# EAGLE board 001000-004 (EAGLE 9.4.0)
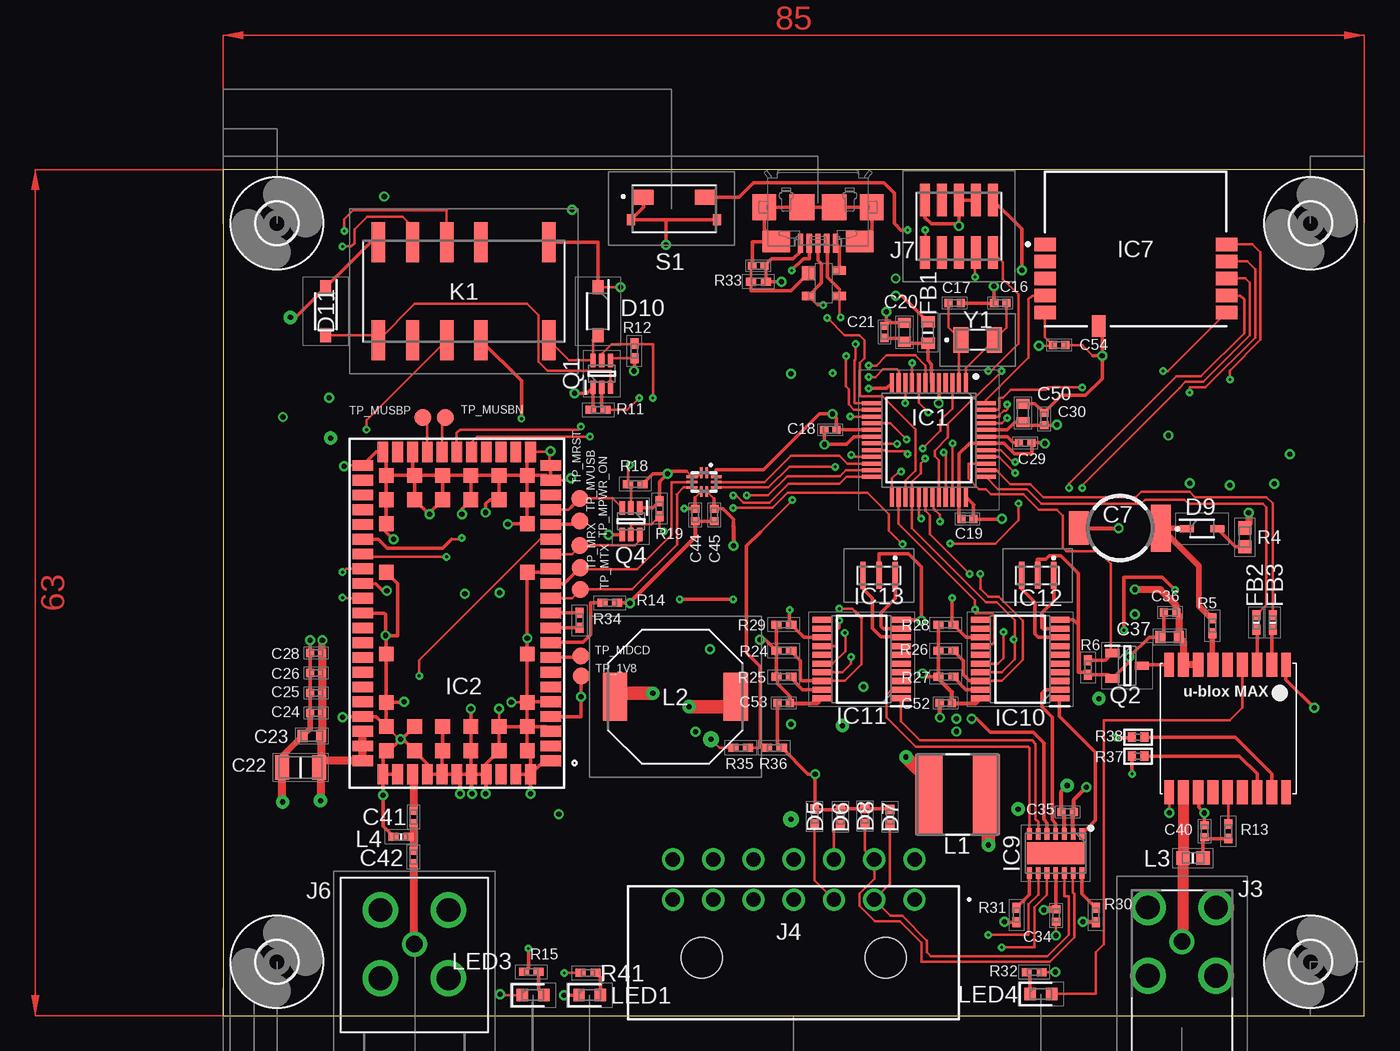
[diagram p6: board, top side]
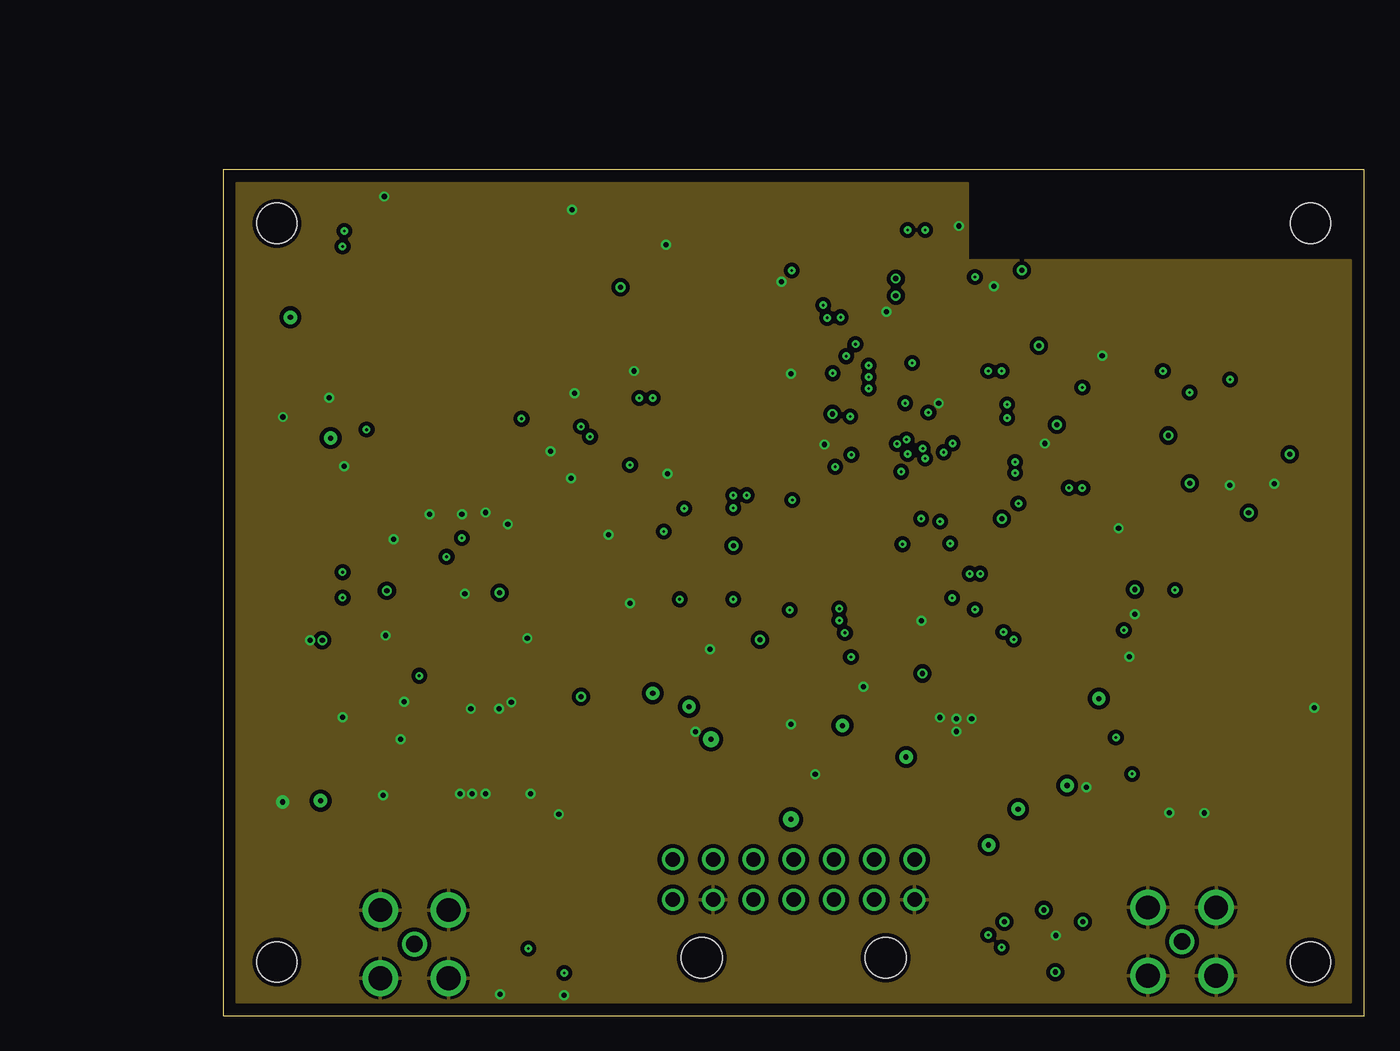
[diagram p7: board, inner layer Route2]
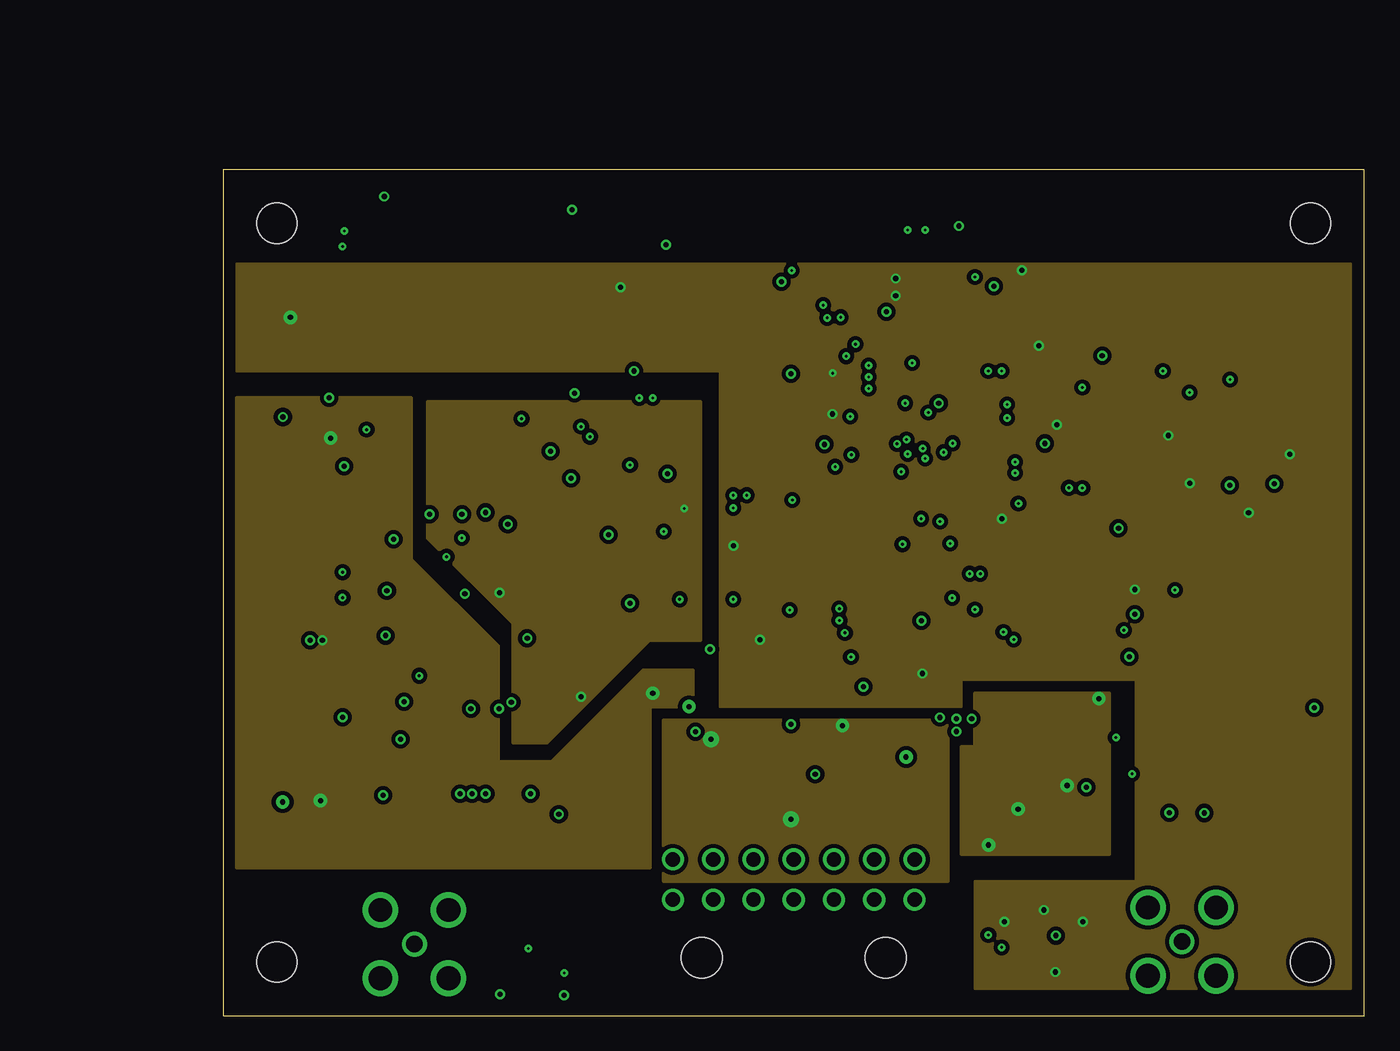
[diagram p8: board, inner layer Route15]
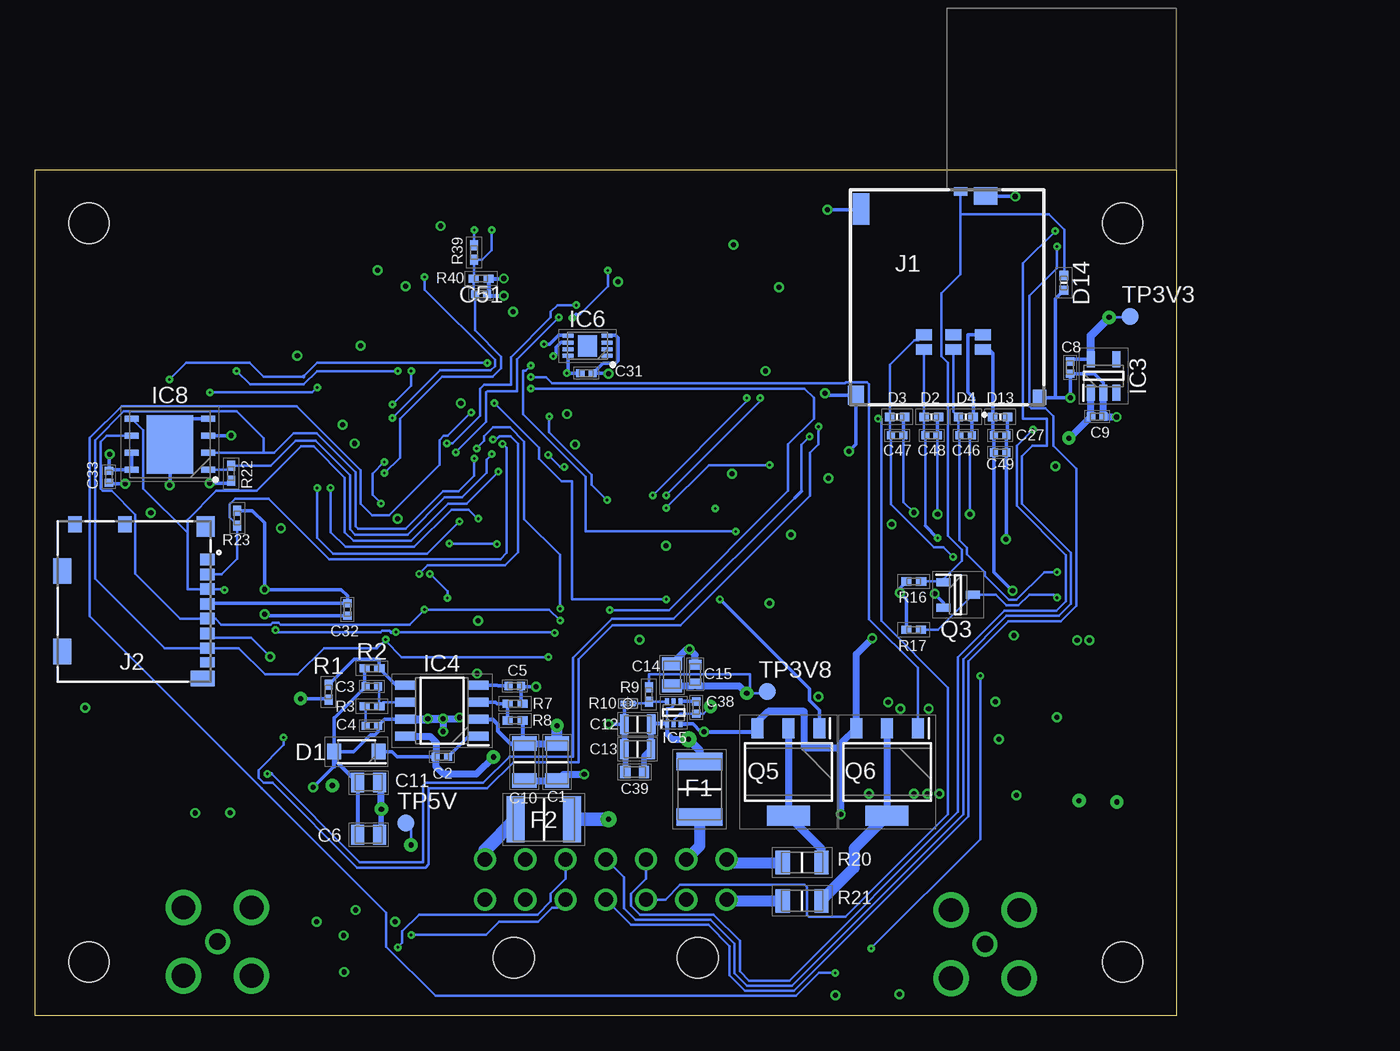
[diagram p9: board, bottom side, seen from below]

Size 85 x 63 mm. Coordinates in mm from the lower left corner, seen from the top.
Outline: 0,0 85,0 85,63 0,63 0,0
Copper layers (1*2*15*16): Top 0.048259375mm / dielectric 0.10921875mm / Route2 0.03048125mm / dielectric 47mil / Route15 0.03048125mm / dielectric 0.10921875mm / Bottom 0.048259375mm
Design rules "SparkFun-4-layer-TIGHT *": minimum track width 8mil, minimum drill 8mil, track to track 7mil, track to pad 7mil, pad to pad 7mil, via to via 7mil, smd to smd 7mil, copper to edge 7mil, drill to drill 7mil, minimum pad ring 7mil, minimum via ring 7mil, stop-mask expansion 4mil, vias tented up to drill 25mil, thermal gap 10mil
Net classes: 1 ant_wide: width 0.8 mm; 2 signal: width 0.203 mm, drill 0.203 mm, clearance 0.152 mm

## Footprints (pad centres in the part's own frame; a part is rotated, then mirrored left to right if it is on the bottom)
CAPC3216X180N = smd 1.07 x 1.82: 1 -1.38,0; 2 1.38,0
CAPC1005X55N = smd 0.6 x 0.62: 1 -0.46,0; 2 0.46,0
CAPC2012X145N = smd 0.97 x 1.47: 1 -0.83,0; 2 0.83,0
DSK-414_HL = smd 3.5 x 1.5: 1 0,3.05 | smd 2.5 x 1.5: 2 0,-3.05
CAPC2012X100N = smd 0.62 x 1.47: 1 -1,0; 2 1,0
CAPC1608X90N = smd 0.75 x 0.94: 1 -0.7,0; 2 0.7,0
SODFL3617X108N = smd 1.03 x 1.17: 1 -1.65,0; 2 1.65,0
DIONC1005X43N = smd 0.7 x 0.65: 1 -0.55,0; 2 0.55,0
SOD2513X110N = smd 1.05 x 0.5: 1 -1.138,0; 2 1.138,0
SOD3716X135N = smd 1.05 x 0.85: 1 -1.8,0; 2 1.8,0
SOT190P230X110-4N = smd 1 x 1: 1 -1.15,0.75 | smd 1 x 0.6: 2 -1.15,-0.95; 3 1.15,-0.95; 4 1.15,0.95
FUSC4632X62N = smd 1.31 x 3.43: 1 -2.065,0; 2 2.065,0
FUSC4632X194N = smd 1.35 x 3.43: 1 -2.1,0; 2 2.1,0
BEADC1608X95N = smd 0.85 x 1: 1 -0.8,0; 2 0.8,0
BEADC1005X55N = smd 0.75 x 0.6: 1 -0.55,0; 2 0.55,0
3,0 = hole 3: 0,0
QFP50P900X900X120-48N = smd 1.475 x 0.3: 1 -4.238,2.75; 2 -4.238,2.25; 3 -4.238,1.75; 4 -4.238,1.25; 5 -4.238,0.75; 6 -4.238,0.25; 7 -4.238,-0.25; 8 -4.238,-0.75; 9 -4.238,-1.25; 10 -4.238,-1.75; 11 -4.238,-2.25; 12 -4.238,-2.75; 25 4.238,-2.75; 26 4.238,-2.25; 27 4.238,-1.75; 28 4.238,-1.25; 29 4.238,-0.75; 30 4.238,-0.25; 31 4.238,0.25; 32 4.238,0.75; 33 4.238,1.25; 34 4.238,1.75; 35 4.238,2.25; 36 4.238,2.75 | smd 0.3 x 1.475: 13 -2.75,-4.238; 14 -2.25,-4.238; 15 -1.75,-4.238; 16 -1.25,-4.238; 17 -0.75,-4.238; 18 -0.25,-4.238; 19 0.25,-4.238; 20 0.75,-4.238; 21 1.25,-4.238; 22 1.75,-4.238; 23 2.25,-4.238; 24 2.75,-4.238; 37 2.75,4.238; 38 2.25,4.238; 39 1.75,4.238; 40 1.25,4.238; 41 0.75,4.238; 42 0.25,4.238; 43 -0.25,4.238; 44 -0.75,4.238; 45 -1.25,4.238; 46 -1.75,4.238; 47 -2.25,4.238; 48 -2.75,4.238
SARA-U201-03B = smd 1.5 x 0.8: 1 1,11; 2 1,9.9; 3 1,8.8; 4 1,7.7; 5 1,6.6; 6 1,5.5; 7 1,4.4; 8 1,3.3; 9 1,2.2; 10 1,1.1; 11 1,0; 12 1,-1.1; 13 1,-2.2; 14 1,-3.3; 15 1,-4.4; 16 1,-5.5; 17 1,-6.6; 18 1,-7.7; 19 1,-8.8; 20 1,-9.9; 21 1,-11; 33 15,-11; 34 15,-9.9; 35 15,-8.8; 36 15,-7.7; 37 15,-6.6; 38 15,-5.5; 39 15,-4.4; 40 15,-3.3; 41 15,-2.2; 42 15,-1.1; 43 15,0; 44 15,1.1; 45 15,2.2; 46 15,3.3; 47 15,4.4; 48 15,5.5; 49 15,6.6; 50 15,7.7; 51 15,8.8; 52 15,9.9; 53 15,11 | smd 0.8 x 1.5: 22 2.5,-12; 23 3.6,-12; 24 4.7,-12; 25 5.8,-12; 26 6.9,-12; 27 8,-12; 28 9.1,-12; 29 10.2,-12; 30 11.3,-12; 31 12.4,-12; 32 13.5,-12; 54 13.5,12; 55 12.4,12; 56 11.3,12; 57 10.2,12; 58 9.1,12; 59 8,12; 60 6.9,12; 61 5.8,12; 62 4.7,12; 63 3.6,12; 64 2.5,12 | smd 1.1 x 1.1: 65 2.75,10.25; 66 4.85,10.25; 67 6.95,10.25; 68 9.05,10.25; 69 11.15,10.25; 70 13.25,10.25; 71 2.75,8.45; 72 4.85,8.45; 73 6.95,8.45; 74 9.05,8.45; 75 11.15,8.45; 76 13.25,8.45; 77 2.75,6.65; 78 13.25,6.65; 79 2.75,3.05; 80 13.25,3.05; 81 2.75,-3.05; 82 13.25,-3.05; 83 2.75,-6.65; 84 13.25,-6.65; 85 2.75,-8.45; 86 4.85,-8.45; 87 6.95,-8.45; 88 9.05,-8.45; 89 11.15,-8.45; 90 13.25,-8.45; 91 2.75,-10.25; 92 4.85,-10.25; 93 6.95,-10.25; 94 9.05,-10.25; 95 11.15,-10.25; 96 13.25,-10.25
SOT95P282X130-5N = smd 1.2 x 0.6: 1 -1.25,0.95; 2 -1.25,0; 3 -1.25,-0.95; 4 1.25,-0.95; 5 1.25,0.95
SOIC127P600X175-8N = smd 1.525 x 0.65: 1 -2.712,1.905; 2 -2.712,0.635; 3 -2.712,-0.635; 4 -2.712,-1.905; 5 2.712,-1.905; 6 2.712,-0.635; 7 2.712,0.635; 8 2.712,1.905
SOTFL50P160X60-6N = smd 0.475 x 0.3: 1 -0.838,0.5; 2 -0.838,0; 3 -0.838,-0.5; 4 0.838,-0.5; 5 0.838,0; 6 0.838,0.5
SON50P300X200X60-9N = smd 0.85 x 0.3: 1 -1.45,0.75; 2 -1.45,0.25; 3 -1.45,-0.25; 4 -1.45,-0.75; 5 1.45,-0.75; 6 1.45,-0.25; 7 1.45,0.25; 8 1.45,0.75 | smd 1.4 x 1.6: 9 0,0
XCVR_SPBTLE-RF = smd 1.6 x 1: 1 -6.75,0.33; 2 -6.75,-0.94; 3 -6.75,-2.21; 4 -6.75,-3.48; 5 -6.75,-4.75; 7 6.75,-4.75; 8 6.75,-3.48; 9 6.75,-2.21; 10 6.75,-0.94; 11 6.75,0.33 | smd 1 x 1.6: 6 -2.75,-5.75
SON127P600X500X80-9N = smd 1.05 x 0.45: 1 -2.85,1.905; 2 -2.85,0.635; 3 -2.85,-0.635; 4 -2.85,-1.905; 5 2.85,-1.905; 6 2.85,-0.635; 7 2.85,0.635; 8 2.85,1.905 | smd 3.45 x 4.35: 9 0,0
SON65P300X450X100-15N = smd 0.85 x 0.35: 1 -1.45,1.95; 2 -1.45,1.3; 3 -1.45,0.65; 4 -1.45,0; 5 -1.45,-0.65; 6 -1.45,-1.3; 7 -1.45,-1.95; 8 1.45,-1.95; 9 1.45,-1.3; 10 1.45,-0.65; 11 1.45,0; 12 1.45,0.65; 13 1.45,1.3; 14 1.45,1.95 | smd 1.65 x 4.25: 15 0,0
SOP65P640X120-20N = smd 1.475 x 0.45: 1 -2.938,2.925; 2 -2.938,2.275; 3 -2.938,1.625; 4 -2.938,0.975; 5 -2.938,0.325; 6 -2.938,-0.325; 7 -2.938,-0.975; 8 -2.938,-1.625; 9 -2.938,-2.275; 10 -2.938,-2.925; 11 2.938,-2.925; 12 2.938,-2.275; 13 2.938,-1.625; 14 2.938,-0.975; 15 2.938,-0.325; 16 2.938,0.325; 17 2.938,0.975; 18 2.938,1.625; 19 2.938,2.275; 20 2.938,2.925
CSTCE16M0V53CR0 = smd 0.4 x 2: 1 1.2,0; 2 0,0; 3 -1.2,0
SF56S006V4BR2000 = smd 1.2 x 0.8: 1 2.66,-12.09; 2 0.47,-12.09; 3 -1.72,-12.09; 4 2.66,-10.99; 5 0.47,-10.99; 6 -1.72,-10.99 | smd 1.75 x 1.3: 7 2.87,-0.65 | smd 1 x 0.65: 8 1,-0.325 | smd 1.2 x 2.35: 9 -6.4,-1.625 | smd 1.2 x 1.4: 10 -6.8,-15.5 | smd 1 x 1.1: 11 6.9,-15.65
1040310811 = smd 0.85 x 1.1: 1 3.105,0.25; 2 2.005,0.25; 3 0.905,0.25; 4 -0.195,0.25; 5 -1.295,0.25; 6 -2.395,0.25; 7 -3.495,0.25 | smd 0.75 x 1.1: 8 -4.545,0.25 | smd 1.17 x 1.8: 9 -5.755,0.6 | smd 1.9 x 1.35: 10 -3.73,11.075; 11 2.24,11.075 | smd 1.2 x 1: 12 5.74,10.1; 13 5.74,6.4 | smd 1.55 x 1.35: 14 5.565,0.375
FA1NCRPPCB8 = drill 1.77 pad 2.655: 1 3.85,-2.54; 2 8.93,-2.54; 3 8.93,2.54; 4 3.85,2.54 | drill 1.24 pad 1.86: 5 6.39,0
43045-1400 = drill 1.07 pad 1.65: 1 9,8.92; 2 6,8.92; 3 3,8.92; 4 0,8.92; 5 -3,8.92; 6 -6,8.92; 7 -9,8.92; 8 9,11.92; 9 6,11.92; 10 3,11.92; 11 0,11.92; 12 -3,11.92; 13 -6,11.92; 14 -9,11.92 | hole 3.05: -6.85,4.6; 6.85,4.6
ZX62-AB-5PA = smd 0.4 x 1.35: 1 -1.3,3.025; 2 -0.65,3.025; 3 0,3.025; 4 0.65,3.025; 5 1.3,3.025 | smd 2.1 x 1.6: 6 3.1,2.9; 11 -3.1,2.9 | smd 1.8 x 1.9: 7 4,0.35; 10 -4,0.35 | smd 1.9 x 1.9: 8 1.2,0.35; 9 -1.2,0.35
FA1NDRPPCB8 = drill 1.77 pad 2.655: 1 0,0; 2 5.08,0; 3 0,-5.08; 4 5.08,-5.08 | drill 1.24 pad 1.86: 5 2.54,-2.54
M503600542R = smd 0.74 x 2.4: 1 -2.54,-1.95; 2 -2.54,1.95; 3 -1.27,-1.95; 4 -1.27,1.95; 5 0,-1.95; 6 0,1.95; 7 1.27,-1.95; 8 1.27,1.95; 9 2.54,-1.95; 10 2.54,1.95
EE25TNU = smd 1 x 3: 1 -6.35,-3.645; 3 -1.27,-3.645; 4 1.27,-3.645; 5 3.81,-3.645; 6 6.35,-3.645; 7 6.35,3.645; 8 3.81,3.645; 9 1.27,3.645; 10 -1.27,3.645; 12 -6.35,3.645
SRN6045_1 = smd 2.01 x 6: 1 -2.15,0; 2 2.15,0
SRU10484R7Y = smd 1.8 x 3.6: 1 -4.5,0; 2 4.5,0
INDC1608X95N = smd 1 x 1: 1 -0.75,0; 2 0.75,0
INDC1005X55N = smd 0.75 x 0.6: 1 -0.55,0; 2 0.55,0
LEDC1608X90N = smd 0.85 x 0.95: 1 -0.8,0; 2 0.8,0
LEDC1608X80N = smd 0.85 x 0.95: 1 -0.8,0; 2 0.8,0
SOT65P210X100-6N = smd 1 x 0.4: 1 -1,0.65; 2 -1,0; 3 -1,-0.65; 4 1,-0.65; 5 1,0; 6 1,0.65
SOT95P230X110-3N = smd 1.05 x 0.6: 1 -1.1,0.95; 2 -1.1,-0.95; 3 1.1,0
SOT230P700X170-4N = smd 1.5 x 0.9: 1 -3.25,2.3; 2 -3.25,0; 3 -3.25,-2.3 | smd 1.5 x 3.2: 4 3.25,0
RESC1005X40N = smd 0.75 x 0.6: 1 -0.55,0; 2 0.55,0
RESC1508X50N = smd 1 x 0.95: 1 -0.7,0; 2 0.7,0
RESC0603X26N = smd 0.44 x 0.42: 1 -0.34,0; 2 0.34,0
RESC1005X35N = smd 0.7 x 0.6: 1 -0.55,0; 2 0.55,0
RESC3116X65N = smd 1.05 x 1.75: 1 -1.45,0; 2 1.45,0
R0402 = smd 0.6 x 0.7: 1 -0.476,0; 2 0.476,0
TL4100AF120QG = smd 1.45 x 1.1: 1 -2.075,0.837; 2 2.475,0.837 | smd 0.6 x 0.85: 3 -3,-0.838; 4 3.4,-0.838
B1,27 = smd 1.27 x 1.27: TP 0,0
RSW(RPUQFNN10) = smd 0.2 x 0.8: 1 -0.2,-0.7; 2 0.2,-0.7; 6 0.2,0.7; 7 -0.2,0.7 | smd 0.8 x 0.2: 3 0.9,-0.4; 4 0.9,0; 5 0.9,0.4; 8 -0.9,0.4; 9 -0.9,0; 10 -0.9,-0.4
MAX-M8 = smd 1.8 x 0.7: 1_GND 4.95,-4.4; 9_RESET_N 4.95,4.3; 10_GND -4.55,4.3; 18_SAFEBOOT_N -4.55,-4.4 | smd 1.8 x 0.8: 2_TXD 4.95,-3.35; 3_RXD 4.95,-2.25; 4_TIMEPULSE 4.95,-1.15; 5_EXTINT 4.95,-0.05; 6_V_BCKP 4.95,1.05; 7_VCC_IO 4.95,2.15; 8_VCC 4.95,3.25; 11_RF_IN -4.55,3.25; 12_GND -4.55,2.15; 13_LNA_EN -4.55,1.05; 14_VCC_RF -4.55,-0.05; 15_V_ANT/RESERVED -4.55,-1.15; 16_SDA -4.55,-2.25; 17_SCL -4.55,-3.35
ABS0716632768KHZT = smd 1.1 x 1.9: 1 -1.25,0; 2 1.25,0

## Placement (x,y rotation side)
C1  C3216X7R1V106K160AC  [CAPC3216X180N]  46.13,18.88 90 bottom
C2  100n  [CAPC1005X55N]  54.71,19.27 0 bottom
C3  10p  [CAPC1005X55N]  59.92,24.49 0 bottom
C4  2n2  [CAPC1005X55N]  59.92,21.58 180 bottom
C5  8n2  [CAPC1005X55N]  49.28,24.55 180 bottom
C6  10u  [CAPC2012X145N]  60.17,13.46 0 bottom
C7  DSK-3R3H224U-HL  [DSK-414_HL]  66.8,36.3 270 top
C8  1u  [CAPC1005X55N]  7.92,48.25 90 bottom
C9  1u  [CAPC1005X55N]  5.89,44.6 180 bottom
C10  C3216X7R1V106K160AC  [CAPC3216X180N]  48.58,18.88 90 bottom
C11  10u  [CAPC2012X145N]  60.17,17.35 0 bottom
C12  C2012X5R1V106K085AC  [CAPC2012X100N]  40.12,21.69 0 bottom
C13  C2012X5R1V106K085AC  [CAPC2012X100N]  40.13,19.83 0 bottom
C14  C2012X5R1A336M125AC  [CAPC2012X145N]  37.56,25.37 270 bottom
C15  GRM188R71H104KA93D  [CAPC1608X90N]  35.85,25.41 270 bottom
C16  20p  [CAPC1005X55N]  57.89,53.06 0 top
C17  20p  [CAPC1005X55N]  54.48,53.06 180 top
C18  100n  [CAPC1005X55N]  45.23,43.63 0 top
C19  100n  [CAPC1005X55N]  55.44,36.97 0 top
C20  10u  [CAPC1608X90N]  50.75,50.89 270 top
C21  100n  [CAPC1005X55N]  49.26,50.92 270 top
C22  100u  [CAPC3216X180N]  5.77,18.46 0 top
C23  10u  [CAPC1608X90N]  6.61,20.82 0 top
C24  100n  [CAPC1005X55N]  6.92,22.54 0 top
C25  10n  [CAPC1005X55N]  6.92,24.03 0 top
C26  68p  [CAPC1005X55N]  6.92,25.52 0 top
C27  100n  [CAPC1005X55N]  13.12,43.21 180 bottom
C28  15p  [CAPC1005X55N]  6.92,27 0 top
C29  1u  [CAPC1005X55N]  59.75,42.65 0 top
C30  100n  [CAPC1005X55N]  61.16,44.44 90 top
C31  100n  [CAPC1005X55N]  43.94,47.84 180 bottom
C32  10u  [CAPC1005X55N]  61.75,30.25 90 bottom
C33  100n  [CAPC1005X55N]  79.51,40.13 90 bottom
C34  100n  [CAPC1005X55N]  62.05,7.46 90 top
C35  100n  [CAPC1005X55N]  62.91,15.16 0 top
C36  47p  [CAPC1005X55N]  70.53,30.01 180 top
C37  1u  [CAPC1608X90N]  70.5,28.19 180 top
C38  100n  [CAPC1005X55N]  35.75,22.93 90 bottom
C39  GRM188R71H104KA93D  [CAPC1608X90N]  40.35,18.15 0 bottom
C40  10n  [CAPC1005X55N]  73.11,13.73 270 top
C41  GRM1555C1H150JA01J  [CAPC1005X55N]  14.18,14.79 270 top
C42  GRM1555C1H330JA01J  [CAPC1005X55N]  14.18,11.82 270 top
C43  4n7  [CAPC1005X55N]  39.87,55.84 0 top
C44  100n  [CAPC1005X55N]  35.16,37.28 270 top
C45  100n  [CAPC1005X55N]  36.58,37.28 90 top
C46  GRM1555C1H470JA01D  [CAPC1005X55N]  15.68,43.21 180 bottom
C47  GRM1555C1H470JA01D  [CAPC1005X55N]  20.79,43.21 180 bottom
C48  GRM1555C1H470JA01D  [CAPC1005X55N]  18.24,43.21 180 bottom
C49  GRM1555C1H470JA01D  [CAPC1005X55N]  13.12,41.93 180 bottom
C50  10u  [CAPC1608X90N]  59.57,44.88 90 top
C51  GCM1555C1H101JA16D  [CAPC1005X55N]  51.79,53.72 0 bottom
C52  100n  [CAPC1005X55N]  53.83,23.27 180 top
C53  100n  [CAPC1005X55N]  41.77,23.27 180 top
C54  100n  [CAPC1005X55N]  62.28,49.93 180 top
D1  SS13FL  [SODFL3617X108N]  61.08,19.65 180 bottom
D2  PESD0402-140  [DIONC1005X43N]  18.24,44.58 180 bottom
D3  PESD0402-140  [DIONC1005X43N]  20.79,44.58 180 bottom
D4  PESD0402-140  [DIONC1005X43N]  15.68,44.58 180 bottom
D5  PESD0402-140  [DIONC1005X43N]  44.06,14.82 270 top
D6  PESD0402-140  [DIONC1005X43N]  45.98,14.79 270 top
D7  PESD0402-140  [DIONC1005X43N]  49.67,14.79 270 top
D8  PESD0402-140  [DIONC1005X43N]  47.81,14.86 270 top
D9  BAT60AE6327HTSA1  [SOD2513X110N]  72.93,36.26 0 top
D10  MBR0560-TP  [SOD3716X135N]  27.92,52.45 270 top
D11  MBR0560-TP  [SOD3716X135N]  7.63,52.45 270 top
D12  PRTR5V  [SOT190P230X110-4N]  44.74,54.53 0 top
D13  PESD0402-140  [DIONC1005X43N]  13.12,44.58 180 bottom
D14  PESD0402-140  [DIONC1005X43N]  8.38,54.56 90 bottom
F1  MINISMDC050F-2  [FUSC4632X62N]  35.51,16.86 270 bottom
F2  MINISMDC150F_24-2  [FUSC4632X194N]  47.12,14.61 180 bottom
FB1  BLM18PG471SZ1D  [BEADC1608X95N]  52.5,50.87 270 top
FB2  BLM15HD102SN1D  [BEADC1005X55N]  76.95,29.27 90 top
FB3  BLM15HD102SN1D  [BEADC1005X55N]  78.19,29.27 90 top
H1  MOUNT-HOLE3.0  [3,0]  81,59 0 top
H4  MOUNT-HOLE3.0  [3,0]  81,4 0 top
H5  MOUNT-HOLE3.0  [3,0]  4,4 0 top
H6  MOUNT-HOLE3.0  [3,0]  4,59 0 top
IC1  ATSAMD21G18A-AU  [QFP50P900X900X120-48N]  52.57,42.86 270 top
IC2  SARA-R410M-02B  [SARA-U201-03B]  25.4,29.97 180 top
IC3  AP2112K-3.3TRG1  [SOT95P282X130-5N]  5.42,47.63 90 bottom
IC4  TPS54232D  [SOIC127P600X175-8N]  54.71,22.7 180 bottom
IC5  TPS563231DRLR  [SOTFL50P160X60-6N]  37.44,22.56 90 bottom
IC6  ATECC508A-MAHDA-T  [SON50P300X200X60-9N]  43.86,49.87 180 bottom
IC7  SPBTLE-RF  [XCVR_SPBTLE-RF]  67.98,57.1 0 top
IC8  W25Q16JVZPIQ  [SON127P600X500X80-9N]  74.96,42.54 180 bottom
IC9  TJA1048TK,118  [SON65P300X450X100-15N]  62.01,12.08 270 top
IC10  MCP2515T-I_ST  [SOP65P640X120-20N]  59.37,26.54 180 top
IC11  MCP2515T-I_ST  [SOP65P640X120-20N]  47.56,26.54 180 top
IC12  CSTCE16M0V53C-R0  [CSTCE16M0V53CR0]  60.67,32.78 0 top
IC13  CSTCE16M0V53C-R0  [CSTCE16M0V53CR0]  48.86,32.78 0 top
J1  SF56S006V4BR2000  [SF56S006V4BR2000]  17.08,61.7 0 bottom
J2  1040310811  [1040310811]  71.93,30.85 90 bottom
J3  FA1-NCRP-PCB-8  [FA1NCRPPCB8]  71.43,-0.88 90 top
J4  43045-1400  [43045-1400]  42.5,-0.29 0 top
J5  -  [ZX62-AB-5PA]  44.31,60.54 180 top
J6  FA1-NDRP-PCB-8  [FA1NDRPPCB8]  11.7,7.86 0 top
J7  M50-3600542R  [M503600542R]  54.81,58.78 180 top
K1  EE2-3TNU-L  [EE25TNU]  17.92,53.94 180 top
L1  SRN6045-150M  [SRN6045_1]  54.72,16.46 0 top
L2  SRU1048-4R7Y  [SRU10484R7Y]  33.68,23.74 180 top
L3  27nH  [INDC1608X95N]  72.24,11.72 180 top
L4  LQG15HN39NJ02D  [INDC1005X55N]  13.25,13.31 0 top
LED1  HSMG-C190  [LEDC1608X90N]  27.3,1.52 0 top
LED3  HSMS-C190  [LEDC1608X90N]  23.08,1.52 0 top
LED4  HSMR-C190  [LEDC1608X80N]  60.91,1.61 0 top
Q1  2N7002DW-7-F  [SOT65P210X100-6N]  28.2,47.79 90 top
Q2  2N7002,215  [SOT95P230X110-3N]  67.34,26.05 0 top
Q3  2N7002,215  [SOT95P230X110-3N]  16.26,31.33 0 bottom
Q4  2N7002DW-7-F  [SOT65P210X100-6N]  30.37,36.81 270 top
Q5  BSP76E6433HUMA1  [SOT230P700X170-4N]  28.89,18.14 270 bottom
Q6  BSP76E6433HUMA1  [SOT230P700X170-4N]  21.54,18.14 270 bottom
R1  10k2  [RESC1005X40N]  63.16,24.08 270 bottom
R2  1k96  [RESC1005X40N]  59.92,25.87 0 bottom
R3  28k  [RESC1005X40N]  59.92,23.04 0 bottom
R4  10k  [RESC1508X50N]  76.11,35.62 90 top
R5  0R  [RESC1005X40N]  73.68,29.03 90 top
R6  1M2  [RESC1005X40N]  64.42,25.92 90 top
R7  CRCW040237K4FKED  [RESC1005X40N]  49.26,23.22 180 bottom
R8  CRCW0402169KFKED  [RESC1005X40N]  49.26,21.97 0 bottom
R9  CRCW040253K6FKED  [RESC1005X40N]  39.29,23.91 90 bottom
R10  RC0201FR-0710KL  [RESC0603X26N]  40.85,23.24 0 bottom
R11  1M2  [RESC1005X40N]  27.93,45.1 0 top
R12  1M2  [RESC1005X40N]  30.63,49.5 90 top
R13  10R  [RESC1005X35N]  74.87,13.73 90 top
R14  0R  [RESC1005X40N]  28.8,30.73 0 top
R15  10k2  [RESC1005X40N]  22.95,3.25 180 top
R16  1M2  [RESC1005X40N]  19.55,32.33 180 bottom
R17  1M2  [RESC1005X40N]  19.57,28.72 180 bottom
R18  1M2  [RESC1005X40N]  30.7,39.58 180 top
R19  1M2  [RESC1005X40N]  32.51,37.75 270 top
R20  0R  [RESC3116X65N]  27.87,11.4 180 bottom
R21  0R  [RESC3116X65N]  27.87,8.54 180 bottom
R22  10k2  [RESC1005X40N]  70.42,40.38 270 bottom
R23  10k2  [RESC1005X40N]  69.95,37.04 90 bottom
R24  10k2  [RESC1005X40N]  41.77,27.17 180 top
R25  10k2  [RESC1005X40N]  41.77,25.22 180 top
R26  10k2  [RESC1005X40N]  53.83,27.17 180 top
R27  10k2  [RESC1005X40N]  53.83,25.22 180 top
R28  10k2  [RESC1005X40N]  53.83,29.11 180 top
R29  10k2  [RESC1005X40N]  41.77,29.11 180 top
R30  10k2  [RESC1005X40N]  64.99,7.49 270 top
R31  10k2  [RESC1005X40N]  59.1,7.49 270 top
R32  470R  [RESC1005X35N]  60.41,3.24 0 top
R33  1M2  [RESC1005X40N]  39.87,54.66 180 top
R34  0R  [RESC1005X40N]  26.54,29.44 270 top
R35  40k2  [RESC1005X40N]  38.55,19.93 180 top
R36  10k2  [RESC1005X40N]  41.06,19.93 180 top
R37  DNP  [R0402]  68.16,19.32 0 top
R38  DNP  [R0402]  68.16,20.73 0 top
R39  39R  [RESC1005X40N]  52.31,56.82 270 bottom
R40  10k2  [RESC1005X40N]  51.79,54.89 0 bottom
R41  10k2  [RESC1005X40N]  27.18,3.17 180 top
S1  TL4100AF120QG  [TL4100AF120QG]  33.39,60.1 0 top
TP3V3  TPB1,27  [B1,27]  3.43,52.07 0 bottom
TP3V8  TPB1,27  [B1,27]  30.48,24.13 0 bottom
TP5V  TPB1,27  [B1,27]  57.4,14.35 0 bottom
TP_1V8  TPB1,27  [B1,27]  26.67,25.29 0 top
TP_MDCD  TPB1,27  [B1,27]  26.63,26.77 0 top
TP_MPWR_ON  TPB1,27  [B1,27]  26.55,35.02 0 top
TP_MRST  TPB1,27  [B1,27]  26.58,38.51 0 top
TP_MRX  TPB1,27  [B1,27]  26.59,33.35 0 top
TP_MTX  TPB1,27  [B1,27]  26.61,31.73 0 top
TP_MUSBN  TPB1,27  [B1,27]  16.53,44.55 0 top
TP_MUSBP  TPB1,27  [B1,27]  14.86,44.55 0 top
TP_MVUSB  TPB1,27  [B1,27]  26.58,36.83 0 top
U1  SN74AVC2T245RSWR  [RSW(RPUQFNN10)]  35.82,39.73 180 top
U$1  MAX-M8  [MAX-M8]  74.77,21.17 90 top
Y1  ABS07-32.768KHZ-1-T  [ABS0716632768KHZT]  56.2,50.32 0 top

## Tracks (layer width: path | path; a pad name or v marks a point on that pad's centre or on a via)
12V_IN
  Bottom 1.016: J4.8 51.5,12.32 F2.2
12V_OUT
  Bottom 0.813: F1.2 35.51,12.62 J4.13
+1V8  (via drill 0.2, 0.38)
  Top 0.203: U1.6 35.16,38.57
  Top 0.254: IC2.4 26.67,22.27 v26.67,23.75 TP_1V8.TP | 35.16,38.57 C44.1 34.37,37.74 v34.35,37.76
  Bottom 0.254: R17.2 20.12,31.01 v20.59,31.48 20.59,31.84 R16.2
  pour Route15 (isolate 0.305): 21.59,20.32 21.59,29.21 15.24,35.56 15.24,45.72 29.21,45.72 35.56,45.72 35.56,27.94 31.75,27.94 24.13,20.32
+3V3  (via drill 0.2, 0.38, 0.38 pad 1)
  Top 0.203: U1.7 36.58,38.48 | R32.2 v62,3.24 | U1.10 36.72,40.63 | D10.1 29.57,54.25 v29.59,54.23 | IC7.5 61.23,50.52 C54.2 61.78,49.89 v60.76,49.89 | 48.31,43.63 IC1.17
  Top 0.254: 36.58,38.48 C45.2 37.22,37.74 38,36.95 38,36.46 | D10.1 27.92,57.59 K1.1 | K1.6 10.96,57.59 D11.1 5.38,52 v5,52 | FB1.1 50.57,53.6 v50.1,53.6 | v58,37 57.97,36.97 C19.2 55.9,38.01 55.92,38.03 IC1.36 | R24.2 R25.2 41.29,25.14 41.29,24.71 42.23,23.78 C53.1 | R24.2 R29.2 | 53.28,25.09 R27.2 | R27.2 R26.2 R28.2 | R27.2 52.36,25.22 v52.1,25.48 | J7.1 59.5,58.58 v59.5,55.5 | 36.72,40.63 40.25,40.63 44.42,44.8 v45.4,44.8 45.69,44.51 C18.2 48.31,43.63 | v62.1,44 62.08,43.98 C30.1 59.77,43.98 C50.1 58.99,44.18 58.42,43.61 IC1.44 | v40,28 40.38,28 R24.2 | R31.2 58.26,6.94 v58.2,7 | IC9.11 62.05,10.59 C34.2
  Top 0.305: IC10.20 56.09,23.27 C52.1 54.29,24.08 53.28,25.09 | IC11.20 44.28,23.27 C53.1 | 38,36.46 v38,35 | R30.2 64.11,6.94 v64.05,7
  Top 0.508: R4.2 76.39,36.6 v76.39,37.45 | v67.92,31.73 69.81,31.73 70.99,30.55 C36.1 71.2,29.8 C37.1 71.52,27.87 U$1.8_VCC U$1.7_VCC_IO | C34.2 61.99,7.86 v61.14,7.86
  Bottom 0.203: v5,52 3.5,52 TP3V3.TP
  Bottom 0.254: J2.4 72.13,30.71 C32.2 61.75,31.25 62.23,31.73 v67.92,31.73 67.92,36.68 68.83,37.59 R23.2 | C31.2 v45.4,47.84 45.31,47.93 IC6.8 | IC8.7 IC8.8 79.46,40.63 C33.2 79.51,41.76 v79.47,41.8 | IC8.3 70.42,43.17 v70.4,43.2 | IC3.5 7.75,48.88 C8.2 | v72,39.65 70.6,39.65 R22.2
  Bottom 0.305: v50.1,53.6 51.21,53.6 C51.2 51.24,53.81 R40.2 v50.1,54.89
  Bottom 0.61: v5,52 6.37,50.63 IC3.5
  pour Route15 (isolate 0.305): 1,48 37,48 37,23 55,23 55,25 68,25 68,10 56,10 56,2 84,2 84,56 1,56
+3V8  (via drill 0.38, 0.38 pad 1)
  Top 0.254: L2.2 29.44,24
  Top 0.508: 7.25,18.35 C22.2 7.31,18.62 | 7.38,20.89 C23.2 | 7.39,18.97 7.31,19.05 | C28.2 v7.38,27.94
  Top 0.61: C28.2 C26.2 C25.2 C24.2 7.38,20.89 | IC2.51 IC2.52 IC2.53 7.39,18.97 | 7.25,18.35 v7.25,16 | C23.2 7.31,19.05 7.31,18.62
  Top 1.016: 29.44,24 v32,24
  Bottom 0.203: TP3V8.TP 30.61,24 v32,24 31.75,24.25 31.75,25.4 39.29,25.4 R9.2
  Bottom 0.254: 33,24.56 32.56,24.56 | 7.95,43 v8,43 | 6.35,46.36 IC3.1
  Bottom 0.305: C15.2 35.69,24.56
  Bottom 0.508: 35.69,24.56 32.56,24.56 v32,24 | 7.95,43 C9.2 6.35,46.36 | C14.2 36.02,24.54 C15.2
  pour Route15 (isolate 0.305): 1,11 1,46 14,46 14,34 20.46,27.54 20.46,18.92 24.46,18.92 31.27,25.73 35,25.73 35,23 31.81,23 31.81,11
+12V  (via drill 0.38 pad 1, 0.38 pad 1.2)
  Top 0.203: R35.2 36.98,19.93 v36.34,20.57
  Bottom 0.203: IC5.1 37.94,22.88 37.67,22.88 37.51,23.05 37.51,23.33 IC5.5
  Bottom 0.254: 39.08,21.72 C12.2 39.13,21.67
  Bottom 0.305: 37.94,21 IC5.1 39.08,21.72 | R8.2 48.71,20.39 C10.2 49.59,20.26 50.55,21.21 50.55,21.68 50.93,22.06 IC4.2
  Bottom 0.406: 37.94,21 37.51,20.57 | 39.13,21.67 C13.2 39.65,19.31 C39.2
  Bottom 0.508: 37.51,20.57 v36.34,20.57 | C10.2 C1.2
  Bottom 0.61: v36.34,20.57 35.51,19.75 F1.1
  Bottom 0.813: C1.2 v46.13,21.59
  Bottom 1.016: F2.1 v42.29,14.61
  pour Route15 (isolate 0.305): 54,10 32.81,10 32.81,22 54,22
CAN0H_OUT
  Top 0.203: D8.2 47.81,12.32 J4.9 48.5,10.19 47.4,9.09 47.4,8.17 48.55,7.02 50.42,7.02 52.02,5.42 52.02,4 61.58,4 63.41,5.83 63.41,9.06 63.31,9.15 IC9.13
CAN0L_OUT
  Top 0.203: D7.2 49.67,9.8 J4.2 49.71,7.42 50.58,7.42 52.42,5.58 52.42,4.71 52.72,4.41 61.41,4.41 63,6 63,8.89 62.66,8.89 IC9.12
CAN1H_OUT  (via drill 0.2)
  Top 0.203: J4.10 45.5,13.77 D6.2 | IC9.10 61.36,9 60.44,8.08 60.44,5.08 v58,5.08
  Bottom 0.203: v58,5.08 57.67,5.41 57.67,6.28 56.43,7.53 47.58,7.53 46.6,8.5 46.6,9.09 45.5,10.19 J4.10
CAN1L_OUT  (via drill 0.2)
  Top 0.203: J4.3 44.06,10.07 D5.2 | IC9.9 60.71,9 60,8.29 60,6 v57,6
  Bottom 0.203: v57,6 51.43,6 50.45,6.98 47.55,6.98 46.49,8.04 46.09,8.04 J4.3
CODE_A_IN  (via drill 0.2)
  Top 0.203: v9.02,58.42 9.02,59.31 9.67,59.96 16.65,59.96 K1.4
  Bottom 0.203: J4.11 41.16,10.29 41.15,10.29 41.15,8 40.29,7.14 34.71,7.14 32.9,5.33 32.9,3.14 31.97,2.22 28.64,2.22 15.88,14.99 15.88,26.53 12.65,29.76 8.76,29.76 7.84,30.68 7.84,34.45 11.5,38.11 11.5,41.66 10.74,42.42 9.65,42.42 9.65,44.45 11.43,44.45 11.43,56.01 v9.02,58.42
CODE_A_OUT  (via drill 0.2)
  Top 0.203: K1.5 14.11,58.73 13.35,59.49 10.72,59.49 9.78,58.55 9.78,57.53 9.53,57.28 v8.89,57.28
  Bottom 0.203: J4.4 40.63,6.76 34.87,6.76 33.28,5.18 33.28,2.98 32.13,1.84 28.48,1.84 15.49,14.83 15.49,26.37 12.49,29.38 8.6,29.38 7.46,30.52 7.46,40.72 9.16,42.42 9.16,44.62 9.76,45.22 10.79,45.22 10.96,45.38 10.96,53.6 8.89,55.67 v8.89,57.28
CODE_B_IN  (via drill 0.2)
  Top 0.203: K1.9 10.68,44.33 v10.68,43.63
  Bottom 0.203: J4.12 39.5,10.19 40.6,9.09 40.6,8.17 39.96,7.53 34.46,7.53 32.52,5.58 32.52,3.3 31.82,2.6 28.83,2.6 16.27,15.16 16.27,26.68 12.81,30.14 8.92,30.14 8.22,30.84 8.22,34.29 11.88,37.95 11.88,42.44 v10.68,43.63
CODE_B_OUT  (via drill 0.2)
  Top 0.254: v22.23,44.45 22.23,47.26 K1.10
  Bottom 0.203: v22.23,44.45 21.98,44.45 21.98,29.4 17,24.42 17,15 24.64,7.36 27.36,7.36 27.52,7.52 27.52,9.56 27.7,9.73 36.96,9.73 38.06,8.63 J4.5
G_SCL
  Top 0.254: U$1.17_SCL 78.12,18 75.39,20.73 R38.2
G_SDA
  Top 0.254: U$1.16_SDA 77.02,18 75.71,19.32 R37.2
GND  (via drill 0.38, 0.38 pad 1)
  Top 0.203: U1.2 35.32,40.13 U1.3 34.52,40.53 | U$1.10_GND v70.47,15.1 | C34.1 v62.05,5.96 v62.04,5.96 | LED3.1 20.71,1.52 v20.63,1.6 | 54.76,58.95 54.81,59 | IC2.22 24.32,41.97 | 24.32,41.97 24.45,41.97 v24.38,42.04 | IC2.20 25.77,39.87 v25.91,40.01 | IC2.21 24.32,41.05 24.32,41.97 | IC2.33 9.09,40.97 v9.02,40.89 | 8.94,22.27 v8.89,22.23 | IC2.72 v20.55,22.86 | IC2.77 v21.46,23.32 | 15.37,37.44 v15.37,37.34 | 12.35,19.72 IC2.70 | IC2.76 13.1,20.57 v13.21,20.57 13.3,20.57 | R12.1 29.01,48.95 Q1.4 | C54.1 63.99,49.93 64.77,49.15 | v44.8,42.53 44.77,42.56
  Top 0.254: C24.1 C25.1 C26.1 C28.1 v6.46,27.94 | 31.05,37.78 Q4.1 32.02,37.81 32.08,37.88 32.09,37.88 R19.1 32.51,39.76 v33.11,40.35 | C44.2 C45.1 | U1.1 U1.2 | S1.4 33,59.26 | 33,59.26 S1.3 31.32,60.19 S1.1 | J5.5 43.01,57.99 43,58 43,56.9 42.46,56.36 40.84,56.36 40.84,56.35 C43.2 40.42,55.84 R33.1 v41.59,54.66 v41.6,54.65 | 33,59.26 v33,57.4 | U$1.1_GND 79.17,25.02 v81.27,22.92 | IC2.54 v11.9,16.4 11.9,14.1 L4.1 | IC2.55 IC2.54 | IC2.54 11.9,19.47 IC2.70 | IC2.78 IC2.76 11.4,22.27 IC2.50 8.94,22.27 | IC2.78 IC2.80 12.15,28.25 v12.1,28.3 | IC2.58 IC2.57 15.2,18.77 IC2.69 13.4,20.57 v13.21,20.57 12.35,19.72 | IC2.58 16.3,19.67 IC2.68 IC2.74 | IC2.58 IC2.59 | IC2.59 IC2.60 | IC2.60 18.45,18.02 IC2.67 IC2.73 v18.45,22.86 | IC2.60 IC2.61 | IC2.61 19.6,18.77 IC2.66 IC2.72 IC2.71 | IC2.71 24.05,21.52 IC2.3 | IC2.71 IC2.65 22.9,19.47 IC2.64 | IC2.64 23.9,18.97 IC2.1 | IC2.64 IC2.63 | IC2.71 IC2.77 | IC2.77 22.7,23.37 IC2.5 | IC2.77 IC2.79 v22.65,28.1 IC2.81 24.15,33.02 IC2.14 | v12.1,28.3 13,28.3 13,32.17 IC2.82 | IC2.43 12,29.97 12.1,29.87 v12.1,28.3 | IC2.91 IC2.85 IC2.83 21.22,36.62 v21.2,36.6 | IC2.91 24.05,40.22 IC2.20 IC2.21 | IC2.91 22.65,41.72 IC2.22 | IC2.91 IC2.92 | IC2.92 IC2.86 19.88,38.42 19.56,38.1 v19.56,37.47 | IC2.92 IC2.93 | IC2.93 IC2.87 17.78,37.75 v17.78,37.34 | IC2.93 IC2.94 | IC2.94 IC2.88 15.37,37.44 | IC2.94 IC2.95 | IC2.95 IC2.89 15.33,37.34 v15.37,37.34 | IC2.95 14.1,40.37 IC2.30 | IC2.95 IC2.96 | IC2.96 IC2.90 IC2.84 12.15,36 12.68,35.47 v12.71,35.47 | IC2.33 11.4,41.97 IC2.32 12.15,41.72 IC2.96 | IC10.10 63.34,29.46 63.7,29.11 | 63.7,29.11 63.7,25.55 64.25,25.55 R6.1 65.97,25.37 Q2.2 67.5,26.36 v67.5,26.71 68.98,28.19 C37.2 70.07,28.46 C36.2
  Top 0.254: IC12.2 60.67,34 61.29,34 61.55,34.26 62.39,34.26 63.7,32.95 63.7,29.11 | IC13.2 48.86,34.4 51.04,34.4 52,33.44 v52,29.4 51.94,29.46 IC11.10 | 44.1,15.42 v44.1,17.97 43.57,17.97 R36.1 41.3,20.24 C53.2 | 44.1,15.42 D5.1 | 44.1,15.42 44.17,15.34 D6.1 46.04,15.41 D8.1 49.6,15.41 D7.1 | R12.1 30.63,48.03 v30.6,48 | J7.3 J7.5 54.81,59 v54.81,58.81 v54.8,58.8 | J7.9 52.29,60.71 52.29,59.42 52.76,58.95 54.76,58.95 | 64.77,49.15 v65.48,49.15 | v65.48,49.15 65.48,47.43 64.24,46.2 62.44,46.2 61.16,44.91 C30.2 60.48,45.58 C50.2 | IC1.5 53.32,45.62 v53.3,45.6 | v61.2,42.6 61.15,42.65 C29.2 60.23,42.64 60.23,41.82 58.96,41.82 58.17,42.61 IC1.42 55.61,42.61 54.82,41.82 IC1.35 54.82,37.13 C19.1 | 34.52,40.53 33.28,40.53 v33.11,40.35 | R14.2 30.27,30.73 v30.3,30.7 | IC1.18 47,43.11 46.42,42.53 v44.8,42.53 | IC9.5 61.36,14.38 61.12,14.61 61.12,20.33 60.34,21.11 57.15,21.11 56.16,22.1 v55.75,22.1 | Q4.4 v28.71,35.81 v28.7,35.8 | IC2.59 17.65,17.72 v17.65,16.51 | IC2.60 18.5,16.55 v18.54,16.51 | IC2.61 19.6,16.55 v19.56,16.51 | IC2.64 v22.9,16.51 | IC2.78 13.51,23.32 v13.46,23.37 | IC7.6 65.48,51.1 v65.48,49.15 | v26.16,46.35 27.11,46.35 Q1.1 27.55,45.27 R11.1 | 13.3,20.57 IC2.75 | R18.1 32.02,40.35 v33.11,40.35 | C20.1 49.47,51.59 C21.1 49.4,51.52 v49.4,52.4 | C40.1 73.11,15.07 v73.09,15.09 72.66,15.51 72.66,16.58 U$1.12_GND | 44.77,42.56 C18.1 | C17.1 C16.1 | C16.1 | C16.1 57.41,53.08 v57.41,54.3 | LED1.1 v25.4,1.52
  Top 0.305: C7.2 v66.7,36.3 | C44.2 35.16,35.62 30.27,30.73 | IC9.2 63.31,15.1 C35.2 63.37,16.08 v64.29,17 | v53.4,22.2 53.37,22.23 C52.2
  Top 0.406: C24.1 6.46,21.37 C23.1 4.39,19.3 C22.1
  Top 0.61: v4.43,15.9 4.39,15.94 C22.1
  Bottom 0.203: 75,44.45 75,42.58 IC8.9 | C46.1 15.37,43.06 v15.37,37.34 | C48.1 v17.78,37.34 | C47.1 20.33,38.24 v19.56,37.47 | v67.5,26.71 68.93,28.14 72.18,28.14 J2.6
  Bottom 0.254: IC4.7 58.98,22.06 C4.1 59.46,21.13 59.69,20.9 60.03,20.9 61.28,19.65 D1.2 62.73,22.16 62.71,22.16 C3.1 60.47,24.58 R2.1 | 41.05,19.74 C13.1 41.12,19.84 | R10.1 41.12,23.16 C12.1 v42.29,21.69 | C46.1 15.22,44.49 D4.1 15.13,46 15.53,46.4 15.53,50.69 14.44,50.69 J1.4 | D3.1 20.33,44.49 C47.1 | D2.1 17.78,44.49 C48.1 | IC6.4 42.38,50.65 41.77,50.65 41.61,50.49 41.61,48.75 41.77,48.59 42.71,48.59 43.46,47.84 C31.1 42.34,47.84 v42.3,47.8 | J1.7 14.16,61 v12,61 | J1.9 23.55,60 v26,60 | IC8.4 75,44.45 | IC8.9 74.96,39.54 v75,39.5 | v12.71,35.47 12.66,35.52 C49.1 C27.1 12.57,43.3 D13.1 | J1.11 10.13,46 9,46 | 9,46 v7.9,46 7.9,47.77 C8.1 6.09,47.79 5.42,47.12 IC3.2 | D14.1 9,53.39 9,46 | 36.45,21.72 36.01,21.72 35.43,21.14 v35.18,21.14 | v18,31.4 17.36,30.76 Q3.2 | v64.29,17 62.73,18.57 | v24.38,42.04 23.88,42.54 J1.10 26,46.2 v26.16,46.35 | v47.7,24.5 48.77,24.5 C5.1 48.82,23.33 R7.1 | C9.1 5.42,44.61 | C32.1 67.79,29.79 v67.9,29.9 | C33.1 79.44,39.6 v78.3,39.6
  Bottom 0.305: C6.1 C11.1 62.73,19.08 D1.2 62.73,18.57 | v35.18,21.14 31.44,21.14 Q5.3 | IC5.3 36.45,21.72
  Bottom 0.406: C39.1 41.05,19.74 | 41.12,19.84 C12.1
  Bottom 0.508: v22.65,28.1 23.84,26.91 Q6.3 25,20.23 25,20 | Q5.3 31.19,21.86 30.41,22.65 27.73,22.65 27.73,19.93 25.07,19.93 25,20 | 25,20 v25,15 | v53.4,22.2 53.5,22.1 v54.61,22.1 v54.61,21.15 | C15.1 35.85,26.86 v36.25,27.27 36.49,27.27 C14.1 | 5.42,44.61 IC3.2 | C10.1 C1.1 45.66,17.97 v44.1,17.97 | C9.1 4.47,44.6 v4.45,44.58
  Bottom 0.61: IC4.7 55.79,22.06 v55.75,22.1 v54.61,22.1
  pour Route2 (isolate 0.305): 84,1 84,56.24 55.46,56.24 55.46,62 1,62 1,1
GPS_ANT
  Top 0.254: 71.52,11.76 L3.2 | 71.49,5.57 J3.5
  Top 0.813: U$1.11_RF_IN 71.52,11.76 | L3.2 71.49,5.57
GPS_BCKP
  Top 0.254: U$1.6_V_BCKP 73.68,26.17
  Top 0.406: 73.68,26.17 R5.1
GRST
  Top 0.254: Q2.3 68.51,26.12 U$1.9_RESET_N
LOCK_OUT
  Bottom 0.813: J4.14 33.27,11.4 R20.2
M_ANT_OUT
  Top 0.61: C42.2 14.18,5.38 J6.5
M_SCL  (via drill 0.2)
  Top 0.203: v26.65,43.86 26.44,43.64 17.63,43.64 17.4,43.41 IC2.27
  Top 0.254: R38.1 67.65,20.7 v66.5,20.7
  Bottom 0.203: v66.5,20.7 66.5,20.15 68.37,18.28 68.37,17.72 67.98,17.33 67.33,17.33 61.02,11.02 55.93,11.02 55.69,11.26 55.69,16.92 51.34,16.92 49.38,18.88 44.53,18.88 44.53,26.53 42,29.06 36.94,29.06 27.29,38.72 27.29,41.91 26.65,42.54 v26.65,43.86
M_SDA  (via drill 0.2)
  Top 0.203: v27.32,43.11 18.91,43.11 18.5,42.7 IC2.26
  Top 0.254: R37.1 67.68,18.02 v67.7,18
  Bottom 0.203: 28.42,38.58 37.44,29.56 42.04,29.56 44.94,26.66 44.94,19.28 49.68,19.28 51.63,17.33 55.88,17.33 56.1,17.11 56.1,11.43 60.84,11.43 67.41,18 | v27.32,43.11 27.94,42.49 27.94,39.06
  Bottom 0.254: v67.7,18 67.41,18 | 28.42,38.58 27.94,39.06
M_USB_N
  Top 0.203: IC2.28 16.3,44.32
  Top 0.254: 16.3,44.32 TP_MUSBN.TP
M_USB_P
  Top 0.203: IC2.29 15.2,44.22
  Top 0.254: 15.2,44.22 TP_MUSBP.TP
M_VUSB
  Top 0.254: TP_MVUSB.TP 26.32,36.57 IC2.17
MCTS
  Top 0.254: R34.1 24.42,29.99 IC2.11
MDTR
  Top 0.254: R14.1 27.37,30.73 27.37,28.34 26.81,27.79 24.42,27.79 IC2.9
MRST
  Top 0.203: IC2.18 25.74,37.67 25.88,37.81 | Q4.3 29.02,38.51 TP_MRST.TP
  Top 0.254: TP_MRST.TP 25.88,37.81
MRTS
  Top 0.254: R34.2 24.42,28.89 IC2.10
MRX
  Top 0.203: U1.4 33.4,39.73 33.4,35.81 30.81,33.23 26.46,33.23
  Top 0.254: TP_MRX.TP 26.46,33.23 25.41,32.17 IC2.13
MTX
  Top 0.203: IC2.12 26,31.07 26.61,31.68 TP_MTX.TP 30.46,31.73 33.79,35.06 33.79,38.82 34.3,39.33 U1.5
N$1
  Top 0.254: C21.2 50.48,50.46 C20.2 50.87,50.07 FB1.2 52.5,48.78 52.77,48.51 52.77,47.14 IC1.6
N$2
  Top 0.61: IC2.56 14.18,17.89 C41.1
N$3  (via drill 0.2)
  Top 0.203: v14.6,25.3 14.6,26.46 23.61,35.47 IC2.16
  Top 0.254: R15.2 22.73,3.58 v22.73,5
  Bottom 0.203: v14.6,25.3 14.6,13.13 v22.73,5
N$4
  Top 0.254: R41.1 28.11,2.8 LED1.2
N$5
  Bottom 0.254: IC4.1 52.06,20.73 52.79,20.73 C2.2
N$6  (via drill 0.38 pad 1)
  Top 1.016: L1.1 52.57,17.56 v50.87,19.25
  Bottom 0.254: D1.1 58.42,19.65 58.04,19.27 C2.1 55.12,19.32
  Bottom 0.508: v50.87,19.25 52.13,18 54.61,18 55.17,18.56 C2.1 | IC4.8 55.59,20.79 55.12,20.32 55.12,19.32
N$7
  Bottom 0.203: IC4.6 59.07,23.33 R3.2 59.37,24.4 C3.2
N$8
  Bottom 0.203: C4.2 60.38,22.95 R3.1
N$9
  Bottom 0.254: IC4.5 58.1,24.6 R2.2 59.37,26.55 61.24,26.55 R1.1
N$10
  Top 0.254: D9.2 75.41,34.91 R4.1
N$11
  Bottom 0.254: C5.2 50.53,24.55 50.59,24.6 IC4.4
N$12
  Top 0.254: C7.1 69.89,36.3 | 71.75,36.3 D9.1
  Top 0.406: 69.89,36.3 72.68,33.51 72.68,30.51 73.61,29.58 R5.2 | C7.1 71.75,36.3
N$13
  Bottom 0.254: R8.1 R7.2 50.59,23.22 50.7,23.33 IC4.3
N$15
  Top 0.203: K1.7 14.27,53 22.64,53 23.49,52.15 23.49,48.68 24.16,48.01 28.84,48.01 28.85,48 Q1.3 | D11.2 11.21,50.65
  Top 0.254: 11.21,50.65 K1.7
N$16  (via drill 0.38 pad 1)
  Top 1.016: L2.1 37.44,23 v34.7,23
  Bottom 0.203: IC5.2 37.37,21.79 37.37,22.07 36.98,22.47 C38.1 35.23,22.47 v34.7,23
N$18
  Bottom 0.203: R10.2 39.42,23.24 R9.1 37.97,23.36 IC5.6
N$19
  Top 0.203: K1.12 25.77,48.79 Q1.6 27.55,50.28
  Top 0.254: D10.2 27.55,50.28
N$20
  Bottom 0.254: C38.2 35.76,23.4 IC5.4
N$21  (via drill 0.2)
  Top 0.203: v52.3,58.5 52.3,56.86 J7.10
  Bottom 0.203: R39.1 52.31,58.49 v52.3,58.5
N$22
  Top 0.254: LED3.2 23.5,1.9 R15.1
N$23
  Top 0.254: J5.1 45.89,57.23 D12.4
N$24
  Top 0.254: TP_MDCD.TP 26.53,26.67 IC2.8
N$26
  Top 0.254: IC1.43 58.42,43.11 58.88,42.65 C29.1
N$27
  Top 0.254: IC12.1 61.87,30.87 61,30 61,28.88 61.06,28.82 IC10.9
N$28
  Bottom 0.508: Q6.2 Q6.4
  Bottom 0.813: Q6.4 24,12.43 24,11 26.46,8.54 R21.1
N$29
  Bottom 0.508: Q5.2 Q5.4
  Bottom 0.61: Q5.4 26.42,12.42 R20.1
N$30
  Top 0.254: IC10.8 60.74,28.16 60.47,28.43 60.47,30.78 59.47,31.78 IC12.3
N$31
  Top 0.254: R30.1 63.96,9.07 IC9.14
N$32
  Top 0.254: IC13.1 50.06,31.06 49,30 49,29 49.19,28.82 IC11.9
N$33
  Top 0.254: IC13.3 47.66,31.78 48.38,31.06 48.38,28.84 49.02,28.21 50.45,28.21 IC11.8
N$34
  Top 0.254: R31.1 60.06,9 IC9.8
N$35
  Top 0.203: LED4.2 65,1.61 65,4.71 65.62,5.33 65.62,22 75,22 75.92,22.92 U$1.4_TIMEPULSE
N$36
  Top 0.254: R32.1 60.11,2.99 LED4.1
N$37
  Top 0.203: 39.28,55.97 39.32,55.93 R33.2
  Top 0.254: J5.11 48.31,58.54 J5.10 J5.9 J5.8 J5.7 40.31,58.54 J5.6 39.41,57.64 C43.1 39.28,55.97 | D12.1 42.29,53.98 39.32,53.98 R33.2
N$38
  Top 0.203: 74.87,16.57 R13.2
  Top 0.254: U$1.14_VCC_RF 74.87,16.57
N$39
  Top 0.254: R25.1 42.31,25.11 43.16,24.27 IC11.19
N$40
  Top 0.254: R13.1 73.2,13.18 C40.2 72.99,13.15 L3.1
N$42
  Top 0.254: IC10.19 55.34,24.27 R27.1
N$43
  Top 0.254: 14.15,13.31 14.18,13.34
  Top 0.61: C42.1 14.18,13.34 C41.2 | L4.2 14.15,13.31
PA00_XIN32
  Top 0.203: IC1.1 55.32,48.19 Y1.2 58.35,51.22 C16.2
PA01_XOUT32
  Top 0.203: IC1.2 54.82,50.19 Y1.1 54.02,51.25 C17.2
PA02_C1_SS  (via drill 0.2)
  Top 0.203: 47.56,29.61 47.56,26.17 46.3,24.91 IC11.18 | IC1.3 54.32,45.21 53.44,44.33 53.44,43.56 v52.12,42.24 | v45.9,30.3 46.87,30.3 47.08,30.08
  Top 0.254: 47.56,29.61 47.08,30.08 | IC11.18 43.12,24.91 43,25.03 43,26.41 42.31,27.09 R24.1
  Bottom 0.203: v52.12,42.24 51.56,42.8 51.56,43.13 50.89,43.8 49.63,43.8 48.58,42.75 48.58,36.98 45.9,34.3 v45.9,30.3
PA04_BT_RST  (via drill 0.2)
  Top 0.203: v75,47.37 75,48.03 77.28,50.31 77.28,56.83 76.68,57.43 IC7.11 | IC1.9 v51.32,48.6
  Bottom 0.203: v51.32,48.6 64,48.6 65,47.6 | v75,47.37 73.77,48.6 69.03,48.6 68,47.58 65,47.58
  Bottom 0.254: 65,47.6 65,47.58
PA05_AIN5_LOCK  (via drill 0.2)
  Top 0.203: IC1.10 50.82,45.62 v50.8,45.6
  Top 0.254: v38,31 v34,31
  Bottom 0.203: v38,31 45,31 45,39.79 45.79,39.79 47.47,41.48 47.47,42.27 v50.8,45.6
  Bottom 0.254: v34,31 27.34,24.34 27.34,23.47 26.59,22.72 Q5.1
PA06_AIN6_UNLOCK  (via drill 0.2)
  Top 0.203: IC1.11 50.32,48 50.2,48.12 49.16,48.12 48.6,47.55 v48.08,47.55
  Bottom 0.203: v48.08,47.55 46.95,47.55 46.49,47.09 24.67,47.09 24.59,47.17 23.03,47.17 22.88,47.02 22.88,29.53 19.24,25.89 Q6.1
PA07_C1_INT  (via drill 0.2)
  Top 0.254: IC1.12 49.42,46.7 v48.08,46.7 | IC11.13 43.27,28.16 R29.1 42.2,29.23 v42.2,30.2
  Bottom 0.203: v42.2,30.2 37.8,30.2 28.92,39.08 28.92,42.53 27,44.45 27,46 27.69,46.69 48.07,46.69 v48.08,46.7
PA08_S0_I2C_SDA  (via drill 0.2)
  Top 0.203: IC1.13 47.08,45.61 47.04,45.65 47.04,48.78 47.1,48.85 v47.1,50
  Bottom 0.254: v47.1,50 46.67,50 46.02,50.65 45.34,50.65 IC6.5
PA09_S0_I2C_SCL  (via drill 0.2)
  Top 0.203: IC1.14 47,45.11 46.6,45.51 46.6,46.66 46.4,46.85 v46.4,49.1
  Bottom 0.254: v46.4,49.1 46.33,49.1 46.21,49.22 46.21,49.79 45.85,50.15 45.34,50.15 IC6.6
PA10_TCC0-W2_VIN  (via drill 0.2)
  Top 0.203: 40.01,35.99 v42.4,38.39 | R36.2 40,19.93 | 40,19.93 R35.1 | 40,25 40,19.93 | IC1.15 | IC1.15 v46.71,44.61
  Top 0.254: 40,25 40,26.02 39,27.02 39,34.99 40.01,35.99
  Bottom 0.203: v42.4,38.39 43.54,39.53 43.54,40.26 46.71,43.42 v46.71,44.61
PA11_C0_SS  (via drill 0.2)
  Top 0.203: IC1.16 49.69,44.11 v50.9,42.9 | v56.4,32.9 56.4,31.79 57,31.19 57.79,31.19 57.98,31 58,31 58,30.98 59.57,29.41 59.57,26.48 58,24.91 IC10.18
  Top 0.254: IC10.18 55.59,24.91 55.13,25.38 55.13,26.42 R26.1
  Bottom 0.203: v56.4,32.9 55.76,33.54 50,33.54 49.03,34.51 49.03,42.6 49.58,43.14 50.42,43.14 50.67,42.9 v50.9,42.9
PA12_S2_TX  (via drill 0.2)
  Top 0.203: v45.6,40.87 42.17,40.87 40.63,39.33 U1.8 | v46.8,41.76 46.95,41.61 IC1.21
  Bottom 0.203: v46.8,41.76 45.91,40.87 v45.6,40.87
PA13_S2_RX
  Top 0.203: IC1.22 46.5,41.11 45.91,41.7 42.3,41.7 40.33,39.73 U1.9
PA14_IMM_OFF  (via drill 0.2)
  Top 0.203: v32,46 32,50 30.68,50 R12.2 30.56,49.98 28.94,49.98 28.2,49.23 Q1.5 | v39,38.74 40.6,38.74 42.03,40.17 45.96,40.17 46.4,40.61 IC1.23
  Bottom 0.203: v39,38.74 32,45.74 v32,46
PA15_IMM_ON  (via drill 0.2)
  Top 0.203: IC1.24 46.44,40.11 45.92,39.59 42.1,39.59 40.69,38.18 38.77,38.18 38.21,38.74 v38,38.74 | v31,46 30.1,45.1 R11.2
  Top 0.254: R11.2 28.2,45.38 Q1.2
  Bottom 0.203: v38,38.74 31,45.74 v31,46
PA16_S1_MOSI  (via drill 0.2)
  Top 0.203: v46.31,28.5 46.34,28.47 46.34,27.14 45.4,26.2 44.64,26.2 IC11.16 | v58.12,28.56 58.12,26.62 57.72,26.21 IC10.16 | IC1.25 49.82,40 50.32,40.5 v50.5,40.5
  Top 0.254: v70.9,31.7 69.96,32.64 67.1,32.64 v67.1,28.7
  Bottom 0.203: IC8.5 76.97,43.6 76.97,39.25 73.66,35.94 | 73.66,35.94 73.66,31.75 J2.3 | 73.66,35.94 73.66,36.94 71.53,39.07 68.5,39.07 65.19,42.38 64.28,42.38 61.95,40.05 61.95,36 61.3,35.36 57.02,35.36 54.25,38.13 52.87,38.13 v50.5,40.5 | v58.12,28.56 46.37,28.56 | J2.3 70.95,31.75 | 58.5,28.56 58.62,28.67 59.17,28.67 59.29,28.56 66.96,28.56 v67.1,28.7
  Bottom 0.254: J2.3 | 46.37,28.56 v46.31,28.5 | 70.95,31.75 v70.9,31.7 | 58.5,28.56 v58.12,28.56
PA17_S1_SCK  (via drill 0.2)
  Top 0.203: IC10.14 56.58,27.66 57.28,27.66 57.45,27.82 57.45,29.81 57.28,29.97 56.03,29.97 56,30 v56,30.24 56,30.94 50.3,36.64 50.3,38.6 | IC11.14 45.69,27.52 45.69,27.51 45.69,28.67 45.91,28.88 v45.91,29.42
  Top 0.254: 50.3,38.6 IC1.26
  Bottom 0.203: v45.91,29.42 46.72,30.24 v56,30.24 57.12,29.12 66.73,29.12 66.87,29.26 67.33,29.26 67.47,29.12 71.14,29.12 71.58,29.55 J2.5 74.2,29.55 77.55,32.91 77.55,37.31 79.31,39.07 79.98,39.07 80.14,39.23 80.14,42.73 79.69,43.17 IC8.6
PA18_OTG  (via drill 0.2)
  Top 0.203: IC1.27 50.82,39.83 51.56,40.57 51.56,43.67 49.11,46.11 47.44,46.11 47.44,48.62 47.77,48.95 47.77,50.28 47.38,50.67 46.29,50.67 v45,51.96
  Top 0.254: v42.34,55.49 43.22,56.36 43.66,56.36 J5.4
  Bottom 0.203: 44.73,52.23 44.42,52.23 42.34,54.3 v42.34,55.49
  Bottom 0.254: v45,51.96 44.73,52.23
PA19_S1_MISO  (via drill 0.2)
  Top 0.203: 58.96,28.07 58.96,29.44 57.62,30.78 56.83,30.78 51.32,36.29 IC1.28 51.32,39.76 51.97,40.4 51.97,41.14 v52.3,41.48 | v46.77,26.7 46.77,26.18 46.15,25.57 IC11.17 | IC10.17 58,25.57 58.96,26.53 58.96,27.93
  Top 0.254: 58.96,28.07 v58.9,28 58.96,27.93
  Bottom 0.203: 58.95,27.95 59.54,27.36 63.5,27.36 65.45,25.4 67.89,25.4 69.85,27.36 J2.7 75.36,27.36 80.55,32.55 80.55,42.86 78.41,44.99 70,44.99 68,42.99 68,41.91 | 58.95,27.95 v58.9,28 | 68,41.91 67.21,41.91 65.76,43.36 64.06,43.36 61.15,40.45 61.15,36.45 60.96,36.26 57.43,36.26 54.63,39.05 53.45,39.05 52.3,40.21 v52.3,41.48 | 68,41.91 IC8.2 | 58.95,27.95 57.7,26.7 v46.77,26.7
PA20_S2_MISO  (via drill 0.2)
  Top 0.203: v63,39.3 63,39.59 71,47.59 72.84,47.59 76.06,50.82 76.06,53.34 75.78,53.62 IC7.8 | v51.99,37 51.82,37.17 IC1.29
  Bottom 0.203: 52.05,37 52.72,37.67 54,37.67 56.77,34.9 61.9,34.9 63,36 v63,39.3
  Bottom 0.254: 52.05,37 v51.99,37
PA21_C0_INT  (via drill 0.2)
  Top 0.203: v55.6,32.9 52.64,35.86 52.64,37.27 52.32,37.59 IC1.30
  Top 0.254: v54.3,31.1 54.3,29.2 R28.1 55.33,28.16 IC10.13
  Bottom 0.203: v55.6,32.9 54.3,31.6 v54.3,31.1
PA22_S2_MOSI  (via drill 0.2)
  Top 0.203: v64,39.28 64,39.49 71.22,46.71 71.22,46.73 71.68,47.19 73,47.19 76.47,50.65 76.47,54.56 76.13,54.89 IC7.9 | v53.4,36.8 53.4,37.3 53.09,37.6 53.05,37.6 52.89,37.77 52.89,38.55 IC1.31
  Bottom 0.203: v64,39.28 64,35.58 62.82,34.4 55.8,34.4 v53.4,36.8
PA23_S2_SCK  (via drill 0.2)
  Top 0.203: IC7.7 70.38,48 v70,48 | v58,48 56.04,46.04 55.95,46.04 54,44.09 54,43.07 53,42.07 53,41.67 53.32,41.35 IC1.32
  Bottom 0.203: v58,48 64,48 65,47 69,47 v70,48
PA24_USB_N  (via drill 0.2)
  Top 0.203: v53.67,41.95 53.82,41.8 IC1.33 | v46,52 45.89,52.11 D12.3 45.89,54.09
  Top 0.254: 45.89,54.09 45.01,54.97 45.01,57.46 J5.2
  Bottom 0.203: v46,52 49.11,48.89 49.11,46.51 51.3,46.51 51.4,46.41 51.4,44.22 v53.67,41.95
PA25_USB_P  (via drill 0.2)
  Top 0.203: v54.34,42.62 54.32,42.6 IC1.34 | v44.7,52.9 44.27,52.9 D12.2
  Top 0.254: J5.3 44.31,56.25 44.57,55.99 44.57,54.56 D12.2
  Bottom 0.203: v44.7,52.9 46.1,52.9 46.6,52.4 46.6,52.01 49.57,49.04 49.57,46.96 51.55,46.96 51.86,46.66 51.86,44.67 53.91,42.62 v54.34,42.62
PA27_GRST
  Top 0.203: IC1.39 56.8,41.1 55.5,41.1 55.5,40 56.3,39.2 56.81,39.2 57.19,38.82 59.6,38.82 60.77,37.65 62.1,37.65 62.55,37.21 62.55,34.84 62.8,34.6 65.16,34.6 66.12,33.63 66.12,26.88
  Top 0.254: Q2.1 66.12,26.88 65.71,26.47 R6.2
PA28_M_PWRON  (via drill 0.2)
  Top 0.203: v59,41.23 58.8,41.23 57.92,42.11 IC1.41 | v59.24,38.14 59.24,36.87 57.51,35.15 v54.15,35.15 | v50.6,35.1 49.6,36.1 49.6,37.35 48,38.95 42.05,38.95 40.91,37.8 v38,37.8 | Q4.2 30.37,39.36 R18.2 30.15,40.85 v30.3,41
  Bottom 0.203: v59,41.23 59.87,40.36 59.87,38.78 v59.24,38.14 | v54.15,35.15 50.65,35.15 v50.6,35.1 | v38,37.8 34.8,41 v30.3,41
PA30_SWCLK  (via drill 0.2)
  Top 0.203: v56,55 56,56.75 J7.4 | v58.4,44.5 58.01,44.11 IC1.45
  Bottom 0.203: v56,55 56,54.07 50.76,48.83 50.76,48.37 51.09,48.04 54.86,48.04 v58.4,44.5
PA31_SWDIO  (via drill 0.2)
  Top 0.203: J7.2 58.1,56.08 58.1,54.84 59.22,53.72 59.22,50.03 57.19,48 v57,48 | IC1.46 57.84,44.61 57.84,44.73 58.17,45.06 58.29,45.06 58.4,45.17 v58.4,45.5
  Bottom 0.203: v58.4,45.5 57,46.9 v57,48
PB02_BT_SS  (via drill 0.2)
  Top 0.203: v72,46.41 72,46.78 73.17,46.78 76.87,50.48 76.87,55.59 76.3,56.16 IC7.10 | v64,46.78 61.45,46.78 61.27,46.6 58.67,46.6 58.07,46 57.83,46 57.83,45.34 57.84,45.33 57.84,45.27 57.68,45.11 IC1.47
  Bottom 0.203: v72,46.41 64.37,46.41 v64,46.78
PB03_BT_IRQ
  Top 0.203: IC1.48 56.81,45.81 60,49 60,53.34 60.28,53.62 IC7.4
PB08_M_RST  (via drill 0.2)
  Top 0.203: v48.08,48.41 48.65,48.41 49.4,49.16 51.55,49.16 52.32,48.39 IC1.7 | Q4.5 30.37,36.5 30.46,36.59 31.9,36.59 R19.2 32.51,36.36 v32.82,36.06
  Bottom 0.203: v48.08,48.41 48.48,48.01 48.66,48.01 48.66,44.77 44,40.11 44,36.06 v32.82,36.06
PB09  (via drill 0.2)
  Top 0.203: v52.53,44.91 51.82,45.62 IC1.8 | v25.4,3.17 R41.2
  Bottom 0.203: v52.53,44.91 54.27,43.17 54.57,43.17 54.9,42.85 54.9,41.02 58.65,37.27 59.91,37.27 60.77,38.13 60.77,40.61 65.54,45.38 78.57,45.38 80.93,43.02 80.93,29.74 68.14,16.95 68.13,16.95 58.85,7.67 58.85,5.14 55.17,1.46 28.33,1.46 26.61,3.17 v25.4,3.17
PB10_SD_SS  (via drill 0.2)
  Top 0.203: v50.19,42.58 48.36,42.58
  Top 0.254: 48.36,42.58 IC1.19
  Bottom 0.203: v50.19,42.58 49.89,42.28 49.89,34.45 50.35,34 63.12,34 67.6,38.48 70.13,38.48 70.53,38.08 70.53,37.1 69.95,36.52 R23.1 69.95,34.03 71.12,32.85 J2.2
PB11_FL_SS  (via drill 0.2)
  Top 0.203: IC1.20 49.28,42.11 49.36,42.02 50.77,42.02 v50.99,41.81
  Bottom 0.203: v50.99,41.81 51.4,41.4 51.4,40.41 53.22,38.58 54.49,38.58 57.27,35.81 61.16,35.81 61.55,36.2 61.55,40.25 64.1,42.8 65.6,42.8 67.47,40.93 R22.1 70.71,40.63 IC8.1
PB22_S5_TX
  Top 0.203: FB2.2 77.71,30.58 77.71,37.85 77.45,38.11 71.94,38.11 71.62,38.43 68.68,38.43 68.36,38.11 60.96,38.11 59.87,39.2 57.72,39.2 IC1.37
PB23_S5_RX
  Top 0.203: 57.61,40.61 58.63,39.58 60.11,39.58 61.09,38.61 68,38.61 68.39,39 72,39 72.39,38.61 77.72,38.61 78.19,38.15 FB3.2
  Top 0.254: 57.61,40.61 IC1.38
PWR_ON
  Top 0.203: IC2.15 26,34.37 26.55,34.92 TP_MPWR_ON.TP 30.67,35.02 31.02,35.37 Q4.6
RESETN  (via drill 0.2)
  Top 0.203: v59,40.4 57.79,41.61 IC1.40
  Top 0.254: S1.2 38.43,60.94 39.51,62.02 49.21,62.02 49.99,61.24 49.99,59.01 50.5,58.5 v51,58.5
  Bottom 0.203: v59,40.4 57.84,41.56 57.84,44.46 54.71,47.59 50.94,47.59 50.31,48.22 50.31,49.08 52.25,51.02 C51.1 52.34,53.81 R40.1 52.31,54.91 R39.2 51.73,56.27 51,57 v51,58.5
RXCAN0
  Top 0.254: IC9.4 62.01,14.34 61.77,14.57 61.77,22.23 61,23 61,24 61.27,24.27 IC10.2
RXCAN1
  Top 0.203: IC9.7 60.06,19.94 60,20 51.61,20 49.39,22.23 49.39,23.86 49.79,24.27 IC11.2
SCLK  (via drill 0.2)
  Top 0.203: 17.69,35.47 17,35.47
  Top 0.254: v17.78,35.56 17.69,35.47 | 17,35.47 16.33,34.8 12.2,34.8 11.53,35.47 IC2.38
  Bottom 0.203: J1.3 D2.2 | D2.2 18.79,43.3 | C48.2 18.7,36.48
  Bottom 0.254: D2.2 | 18.79,43.3 C48.2 | 18.7,36.48 v17.78,35.56
SIM_DET  (via drill 0.2)
  Top 0.203: 8.94,31.07 IC2.42
  Top 0.254: v8.89,31.11 8.94,31.07
  Bottom 0.203: v8.89,31.11 9.11,31.33 10.96,31.33 11.74,30.54 12.64,30.54 13.43,31.33 Q3.3 17.77,28.72 R17.1
SIO  (via drill 0.2)
  Top 0.203: v16.64,34.16 10.61,34.16
  Top 0.254: 10.61,34.16 IC2.39
  Bottom 0.203: J1.6 19.22,50.28 19.51,50.28 21.34,48.45 D3.2 21.34,43.3 | v16.64,34.16 17.36,34.89 18.06,34.89 21.25,38.08 C47.2
  Bottom 0.254: 21.34,43.3 C47.2
SRST  (via drill 0.2)
  Top 0.203: v8.89,33.02 9.14,33.27 IC2.40
  Bottom 0.203: J1.2 16.61,44.96 D4.2 16.23,43.3 | v8.89,33.02 9.84,33.02 11.91,30.95 12.47,30.95 14.26,32.74 14.26,33.02 15.58,34.34 15.58,34.85 16.14,35.41 C46.2
  Bottom 0.254: 16.23,43.3 C46.2
SSW
  Bottom 0.203: J1.8 16.08,59.69 | 16.08,59.69 16.08,55.19 17.49,53.78 17.49,49.09 17.01,48.62 17.01,35.74 15.96,34.7 15.96,33.88 17.36,32.49 | 17.41,32.33 R16.1 | D14.2 8.33,55.16 8.33,58.52 9.5,59.69 16.08,59.69
  Bottom 0.254: 17.41,32.33 Q3.1 17.36,32.49
SVCC  (via drill 0.38)
  Top 0.203: v12.19,31.62 11.89,31.62 | 11.37,32.15 10.42,32.15 IC2.41
  Top 0.254: 11.89,31.62 11.37,32.15
  Bottom 0.254: J1.1 13.97,49.61 13.67,49.3 D13.2 13.67,43.3 C27.2 C49.2 13.58,33.01 v12.19,31.62
TXCAN0
  Top 0.254: IC9.1 64.96,14.53 64.96,15.69 64.97,15.69 64.97,19.63 62.31,22.28 IC10.1
TXCAN1
  Top 0.203: IC9.6 60.71,14.43 60.51,14.63 60.51,20.26 60.27,20.51 51.9,20.51 50.5,21.91 IC11.1
UB_GPS_RX
  Top 0.254: FB2.1 77.02,28.64 U$1.3_RXD
UB_GPS_TX
  Top 0.254: U$1.2_TXD 78.12,28.66 FB3.1
UNLOCK_OUT
  Bottom 0.813: J4.7 33.41,8.54 R21.2
VIN  (via drill 0.38 pad 1)
  Top 0.254: L1.2 57.01,16.32
  Top 0.305: IC9.3 62.66,14.95 C35.1 62.45,16.72 v62.87,17.14
  Top 1.016: 57.01,16.32 v57.01,12.7
  Bottom 0.203: v57.01,12.7 57.01,13.96 TP5V.TP
  Bottom 0.254: v65.23,23.61 63.23,23.61 R1.2
  Bottom 0.406: C6.2 59.22,13.58 v59.22,15.37
  Bottom 0.508: v59.22,15.37 59.22,17.23 C11.2
  pour Route15 (isolate 0.305): 55,12 55,20 56,20 56,24 66,24 66,12
(copper drawn outside any net)
  shapes: Top area x2